# Altium schematic sheet top_schema.SchDoc
size A3; SheetNumber: 1; SheetTotal: 1
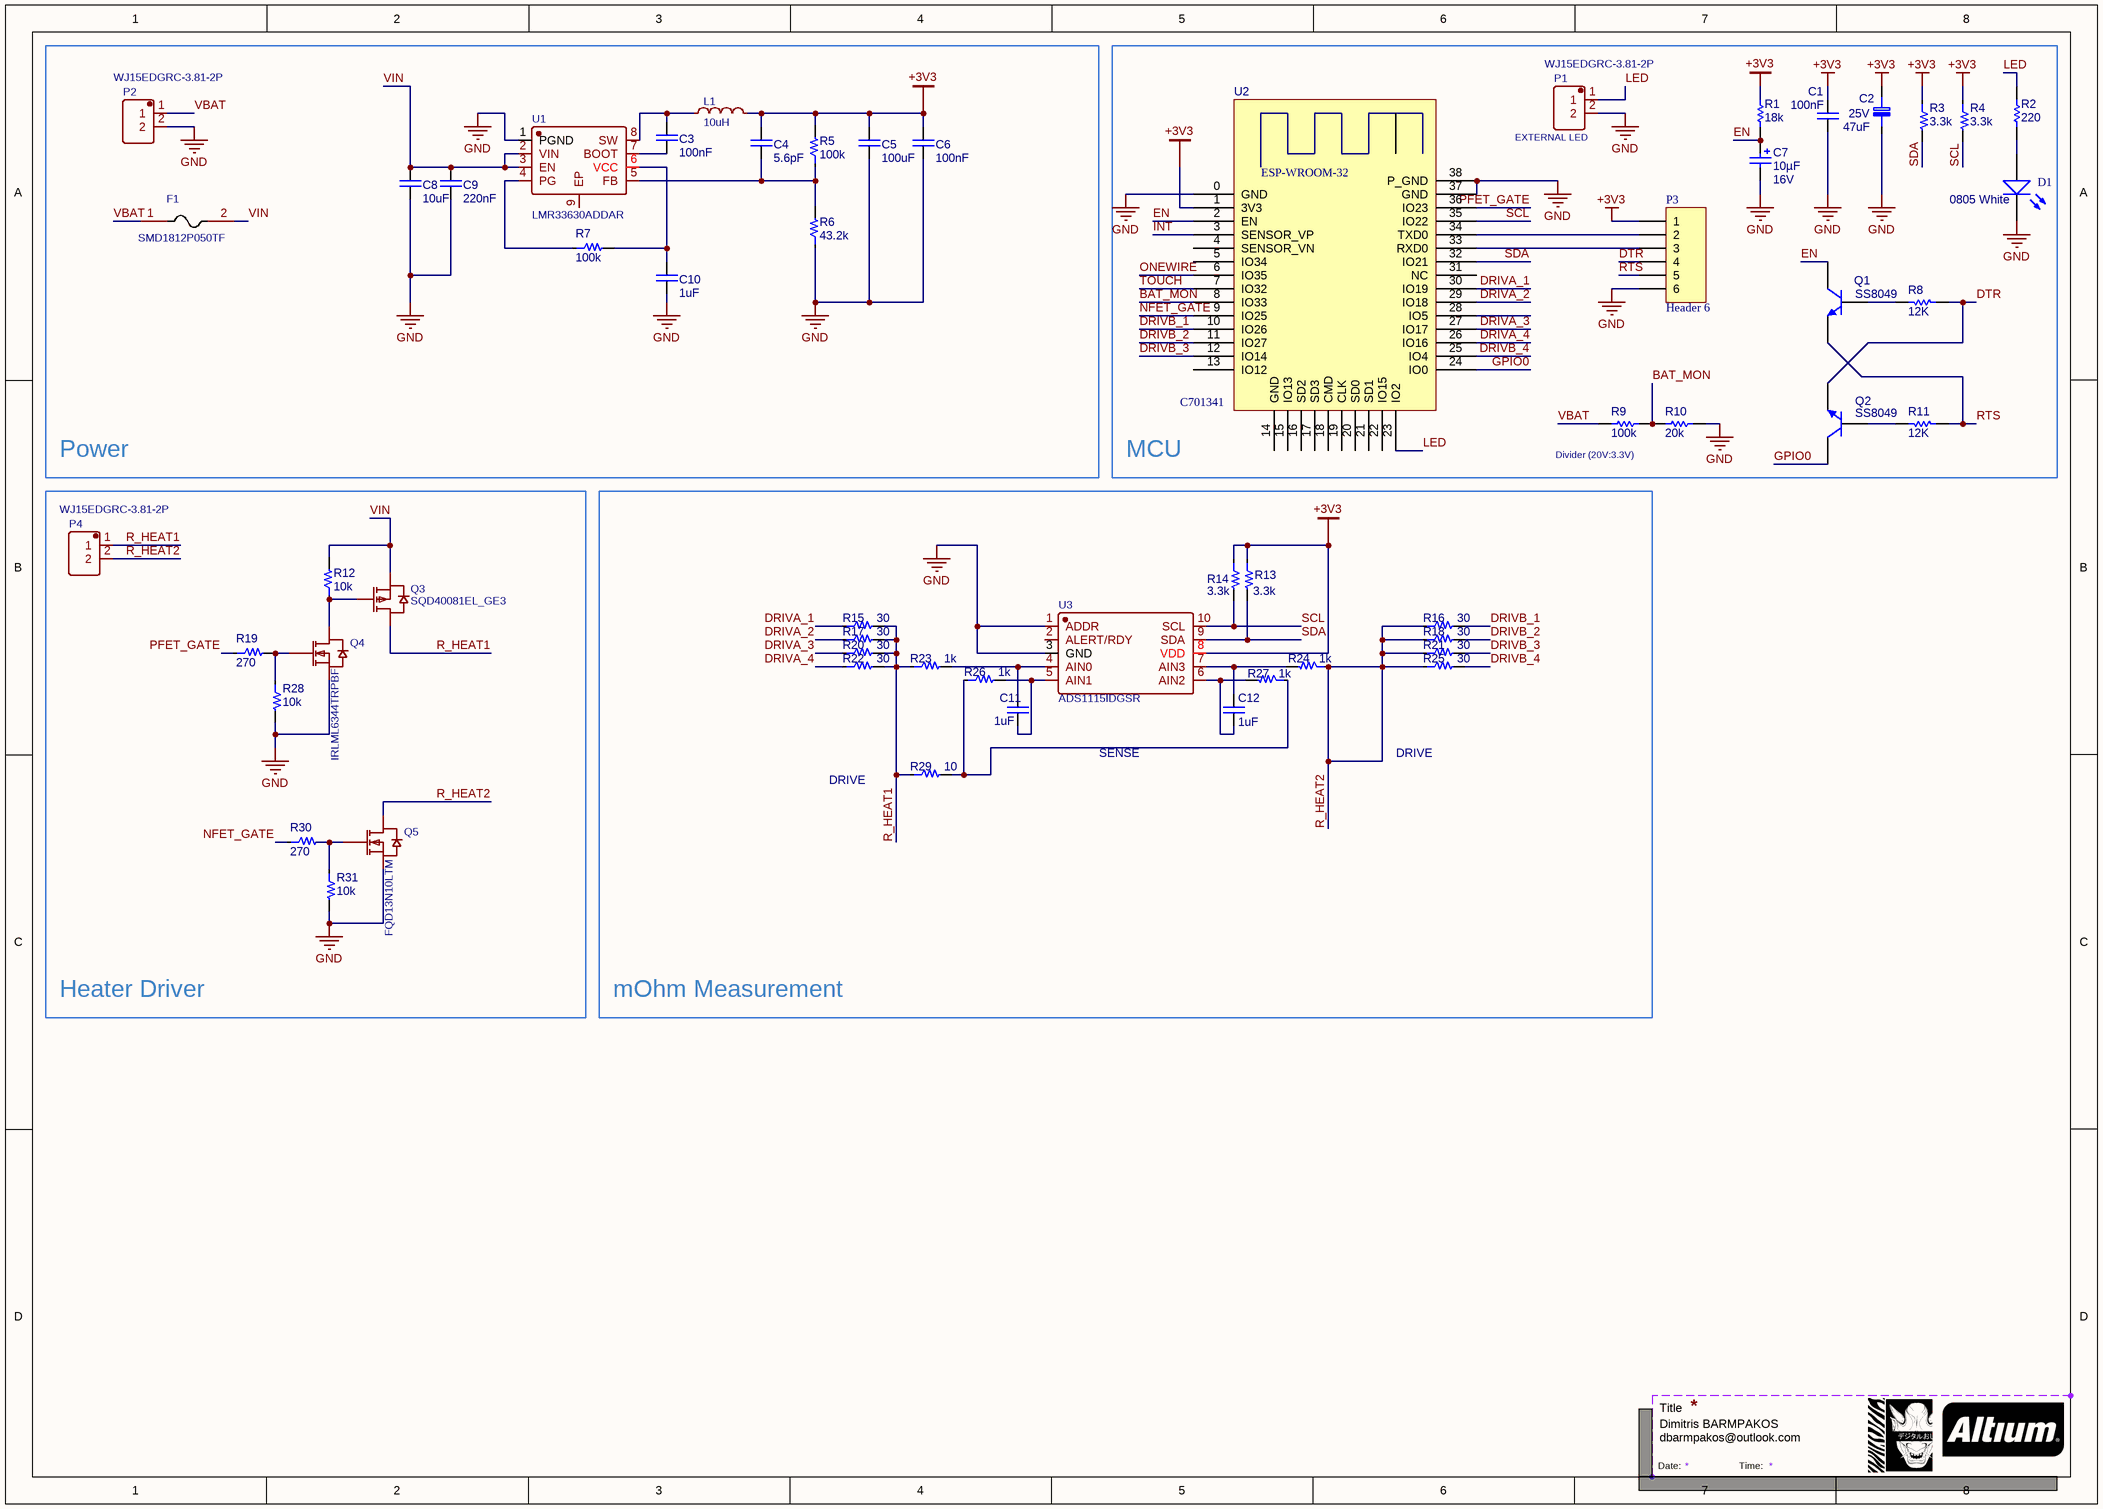
[diagram p0: top_schema.SchDoc]

## Parts
C1  100nF  [CAP_0603]
C2  Voltage Rating: 25V  [CAP SMD 6.3X7.7]  (hidden comment: 47uF)
C3  100nF  [CAP_0603]
C4  5.6pF  [CAP_0603]
C5  100uF  [CAP_0603]
C6  100nF  [CAP_0603]
C7  Capacitance: 10µF  Voltage - Rated: 16V  [CAP_CERAM]  (hidden comment: 10uF)
C8  10uF  [CAP_0603]
C9  220nF  [CAP_0603]
C10  1uF  [CAP_0603]
C11  1uF  [CAP_0603]
C12  1uF  [CAP_0603]
D1  0805 White  [0805_LED_S1]
F1  SMD1812P050TF  [SMT_FUSE]
L1  10uH  [IND-SMD_L5.0-W5.0]
P1  WJ15EDGRC-3.81-2P  [CONN-TH_2P-P3.81_WJ15EDGRC-3.81-2P]
P2  WJ15EDGRC-3.81-2P  [CONN-TH_2P-P3.81_WJ15EDGRC-3.81-2P]
P3  Header 6  [HDR1X6]
P4  WJ15EDGRC-3.81-2P  [CONN-TH_2P-P3.81_WJ15EDGRC-3.81-2P]
Q1  SS8049  [SOT23]
Q2  SS8049  [SOT23]
Q3  SQD40081EL_GE3  [TO-252-3_L6.6-W6.1-P4.57-LS9.9-BR]
Q4  IRLML6344TRPBF  [SOT-23-3_L2.9-W1.6-P1.90-LS2.8-BR]
Q5  FQD13N10LTM  [TO-252-2_L6.6-W6.1-P4.57-LS9.9-TL-CW]
R1  18k  [R0603]
R2  220  [R0603]
R3  3.3k  [R0603]
R4  3.3k  [R0603]
R5  100k  [R0603]
R6  43.2k  [R0603]
R7  100k  [R0603]
R8  12k  [R0603]
R9  100k  [R0603]
R10  20k  [R0603]
R11  12k  [R0603]
R12  10k  [R0603]
R13  3.3k  [R0603]
R14  3.3k  [R0603]
R15  30  [R0603]
R16  30  [R0603]
R17  30  [R0603]
R18  30  [R0603]
R19  270  [R0603]
R20  30  [R0603]
R21  30  [R0603]
R22  30  [R0603]
R23  1k  [R0603]
R24  1k  [R0603]
R25  30  [R0603]
R26  1k  [R0603]
R27  1k  [R0603]
R28  10k  [R0603]
R29  10  [R0603]
R30  270  [R0603]
R31  10k  [R0603]
U1  LMR33630ADDAR  [ESOP-8_L4.9-W3.9-P1.27-LS6.0-TL-EP]
U2  C701341  [ESP32_WROOM]
U3  ADS1115IDGSR  [MSOP-10_L3.0-W3.0-P0.50-LS5.0-BL]

## Blocks framed on the sheet
Power: C3-C6 C8-C10 F1 L1 P2 R5-R7 U1
MCU: C1 C2 C7 D1 P1 P3 Q1 Q2 R1-R4 R8-R11 U2
Heater Driver: P4 Q3-Q5 R12 R19 R28 R30 R31
mOhm Measurement: C11 C12 R13-R18 R20-R27 R29 U3

## Nets
+3V3: C1.1 C2.1 C4.1 C5.1 C6.1 L1.2 P3.1 R1.1 R3.1 R4.1 R5.2 R13.1 R14.1 U2.1(3V3) U3.8(VDD)
GND: C1.2 C2.2 C5.2 C6.2 C7.2 C8.2 C9.2 C10.2 D1.K P1.2 P2.2 P3.6 Q4.2(S) Q5.3(S) R6.1 R10.2 R28.2 R31.2 U1.1(PGND) U2.0(GND) U2.37(GND) U2.38(P_GND) U3.1(ADDR) U3.3(GND)
BAT_MON: R9.2 R10.1 U2.8(IO33)
DRIVA_1: R15.1 U2.30(IO19)
DRIVA_2: R17.1 U2.29(IO18)
DRIVA_3: R20.1 U2.27(IO17)
DRIVA_4: R22.1 U2.26(IO16)
DRIVB_1: R16.2 U2.10(IO26)
DRIVB_2: R18.2 U2.11(IO27)
DRIVB_3: R21.2 U2.12(IO14)
DRIVB_4: R25.2 U2.25(IO4)
DTR: P3.4 Q2.2(E) R8.2
EN: C7.1 Q1.3(C) R1.2 U2.2(EN)
GPIO0: Q2.3(C) U2.24(IO0)
INT: U2.3(SENSOR_VP)
LED: P1.1 R2.2 U2.23(IO2)
NFET_GATE: R30.1 U2.9(IO25)
ONEWIRE: U2.6(IO35)
PFET_GATE: R19.1 U2.36(IO23)
R_HEAT1: P4.1 Q3.3(D) R15.2 R17.2 R20.2 R22.2 R23.1 R29.1
R_HEAT2: P4.2 Q5.2(D) R16.1 R18.1 R21.1 R24.1 R25.1
RTS: P3.5 Q1.2(E) R11.2
SCL: R4.2 R14.2 U2.35(IO22) U3.10(SCL)
SDA: R3.2 R13.2 U2.32(IO21) U3.9(SDA)
TOUCH: U2.7(IO32)
VBAT: F1.1 P2.1 R9.1
VIN: C8.1 C9.1 F1.2 Q3.2(S) R12.2 U1.2(VIN) U1.3(EN)
NetC3_1: C3.1 U1.7(BOOT)
NetC3_2: C3.2 L1.1 U1.8(SW)
NetC4_2: C4.2 R5.1 R6.2 U1.5(FB)
NetC10_1: C10.1 R7.2 U1.6(VCC)
NetC11_1: C11.1 R23.2 U3.4(AIN0)
NetC11_2: C11.2 R26.2 U3.5(AIN1)
NetC12_1: C12.1 R24.2 U3.7(AIN3)
NetC12_2: C12.2 R27.2 U3.6(AIN2)
NetD1_A: D1.A R2.1
NetP3_2: P3.2 U2.34(TXD0)
NetP3_3: P3.3 U2.33(RXD0)
NetQ1_1: Q1.1(B) R8.1
NetQ2_1: Q2.1(B) R11.1
NetQ3_1: Q3.1(G) Q4.3(D) R12.1
NetQ4_1: Q4.1(G) R19.2 R28.1
NetQ5_1: Q5.1(G) R30.2 R31.1
NetR7_1: R7.1 U1.4(PG)
NetR26_1: R26.1 R27.1 R29.2

Not connected (* = marked no-connect by the designer): U1 9(EP); U2 4(SENSOR_VN) 5(IO34) 13(IO12) 14(GND) 15(IO13) 16(SD2) 17(SD3) 18(CMD) 19(CLK) 20(SD0) 21(SD1) 22(IO15) 28(IO5) 31(NC); U3 2(ALERT/RDY)

## Notes on the sheet
- (near P1) EXTERNAL LED
- Divider (20V:3.3V)
- DRIVE
- SENSE
- Title
- Dimitris BARMPAKOS
- dbarmpakos@outlook.com
- Date:
- Time:
- (in symbol ESP 32) ESP-WROOM-32

## Library data of the parts
C1 C3 C6 = CAP - CER 0.1UF 25V X7R 0805: CAP CER 0.1UF 50V X7R 0603; Manufacturer: FH(Guangdong Fenghua Advanced Tech); Manufacturer Part Number: 0603F104M500NT; Pricing 1: 1=0,10000, 10=0,04400, 50=0,02420, 100=0,01980, 500=0,01412, 1000=0,01110 (USD); Case/Package: 0603; Capacitance: 100nF; Voltage Rating: 50V; Voltage: 50V; Length: 1.6mm; Width: 0.031inch; Height: 0.8mm; Thickness: 0.035inch; Depth: 0.8mm; Supplier 1: JLCPCB; Supplier Part Number 1: C42998
C2 = CAP 22UF 63V SMD: CAP ALUM 22UF 20% 25V SMD; Manufacturer: Nichicon; Manufacturer Part Number: UWX1E220MCL1GB; Dielectric Material: Aluminium; Ripple Current: 42mA; Polarity: Polar; Leakage Current: 3uA; Life (Hours): 2000Hour; Dissipation Factor: 0.14%; Supplier 1: Digi-Key; Supplier Part Number 1: 493-2109-1-ND; RoHS: Yes; Category: Aluminum Electrolytic Capacitors; Stock 1: 5009; Pricing 1: 1=0,36000, 10=0,25200, 50=0,17620, 100=0,15110, 500=0,11334 (USD); Mount: Surface Mount; Case/Package: SMD/SMT; Weight: 0.01lb; Contact Plating: Tin; Min Operating Temperature: -40°C; Max Operating Temperature: 85°C; Capacitance: 47uF; Tolerance: 20%; Package Quantity: 1000; Packaging: Tape and Reel; Ripple Current (AC): 42mA; Voltage Rating (DC): 25V; Termination: SMD/SMT; Voltage: 25V; Series: WX; Construction: Cylindrical; Diameter: 6.3mm; Length: 5.4mm; Width: 0.25inch; Height: 5.4mm; Height - Seated (Max): 0.213inch; Lead Pitch: 2.2mm; Radiation Hardening: No; REACH SVHC: No SVHC; Lead Free: Lead Free; RoHS Compliant: Yes; ComponentLink1URL: https://datasheet.ciiva.com/96/e-wx-96336.pdf?src-supplier=Digi-Key; ComponentLink1Description: https://datasheet.ciiva.com/96/e-wx-96336.pdf?src-supplier=Digi-Key; ComponentLink2URL: https://datasheet.ciiva.com/16352/e-wx-16352999.pdf?src-supplier=Future+Electronics; ComponentLink2Description: https://datasheet.ciiva.com/16352/e-wx-16352999.pdf?src-supplier=Future+Electronics; ComponentLink3URL: https://datasheet.ciiva.com/28640/e-wx-28640455.pdf?src-supplier=Element14; ComponentLink3Description: https://datasheet.ciiva.com/28640/e-wx-28640455.pdf?src-supplier=Element14; ComponentLink4URL: https://datasheet.ciiva.com/17529/e-wx-17529096.pdf?src-supplier=Avnet+Europe; ComponentLink4Description: https://datasheet.ciiva.com/17529/e-wx-17529096.pdf?src-supplier=Avnet+Europe; ComponentLink5URL: https://datasheet.ciiva.com/7851/59577-7851769.pdf?src-supplier=Element14; ComponentLink5Description: https://datasheet.ciiva.com/7851/59577-7851769.pdf?src-supplier=Element14; ComponentLink6URL: https://datasheet.ciiva.com/11687/e-wx-11687963.pdf?src-supplier=Avnet; ComponentLink6Description: https://datasheet.ciiva.com/11687/e-wx-11687963.pdf?src-supplier=Avnet; ComponentLink7URL: https://datasheet.ciiva.com/96/e-wx-96334.pdf?src-supplier=Digi-Key; ComponentLink7Description: https://datasheet.ciiva.com/96/e-wx-96334.pdf?src-supplier=Digi-Key; ComponentLink8URL: https://datasheet.ciiva.com/5361/e-wx-11809-5361166.pdf?src-supplier=Mouser; ComponentLink8Description: https://datasheet.ciiva.com/5361/e-wx-11809-5361166.pdf?src-supplier=Mouser; ComponentLink9URL: https://datasheet.ciiva.com/96/e-wx-96335.pdf?src-supplier=Digi-Key; ComponentLink9Description: https://datasheet.ciiva.com/96/e-wx-96335.pdf?src-supplier=Digi-Key
C4 C5 C8-C12 = CAP - CER 0.1UF 25V X7R 0805: CAP CER 0.1UF 50V X7R 0603; Manufacturer: FH(Guangdong Fenghua Advanced Tech); Manufacturer Part Number: 0603F104M500NT; Capacitance: 100nF; Pricing 1: 1=0,10000, 10=0,04400, 50=0,02420, 100=0,01980, 500=0,01412, 1000=0,01110 (USD); Case/Package: 0603; Voltage Rating: 50V; Voltage: 50V; Length: 1.6mm; Width: 0.031inch; Height: 0.8mm; Thickness: 0.035inch; Depth: 0.8mm; Supplier 1: JLCPCB; Supplier Part Number 1: C42998
C7 = Capacitor Polarized: Tantalum Capacitor; Manufacturer: Kemet; Manufacturer Part Number: T491A106K016AT; Manufacturer Size Code: A; Tolerance: ±10%; ESR (Equivalent Series Resistance): 7 Ohm; Type: Molded; Lifetime @ Temp.: 2000 Hrs @ 85°C; Supplier 1: Digi-Key; Supplier Part Number 1: 399-8269-1-ND; RoHS: RoHS Compliant; Category: Capacitors; Stock 1: 46669; Pricing 1: 1=0.41, 10=0.362, 50=0.2198, 100=0.181, 250=0.14476, 500=0.13184, 1000=0.11891 (USD); Packaging: Cut Tape (CT); Operating Temperature: -55°C ~ 125°C; Mounting Type: Surface Mount; Package / Case: 1206 (3216 Metric); Size / Dimension: 0.126" L x 0.063" W (3.20mm x 1.60mm); Height - Seated (Max): 0.071" (1.80mm); Lead Spacing: -; Features: General Purpose; ComponentLink1URL: http://www.kemet.com/Lists/ProductCatalog/Attachments/254/KEM_T2005_T491.pdf; ComponentLink1Description: http://www.kemet.com/Lists/ProductCatalog/Attachments/254/KEM_T2005_T491.pdf
D1 = 0805 LED White: LED; Color: White; ComponentLink1URL: http://www.szlcsc.com/product/details_35468.html; ComponentLink1Description: 供应商链接; Package: 0805; Supplier: LC; SuppliersPartNumber: C34499
F1 = SMD1812P050TF: C12559; BOM_Manufacturer: RUILON; BOM_Supplier: LCSC; BOM_Manufacturer Part: SMD1812P050TF; BOM_Supplier Part: C12558; BOM_JLCPCB Part Class: Extended Part; spicePre: F; spiceSymbolName: SMD1812P050TF
L1 = 10uH: BOM_Manufacturer: Sunlord(顺络); BOM_Manufacturer Part: SWPA5040S100MT; nameAlias: Inductance; BOM_Supplier: LCSC; BOM_Supplier Part: C84608; BOM_JLCPCB Part Class: Extended Part; spicePre: L; spiceSymbolName: SWPA5040S100MT
P1 P2 P4 = WJ15EDGRC-3.81-2P: C8387; BOM_Manufacturer: ReliaPro; spicePre: X; BOM_Supplier: LCSC; BOM_Manufacturer Part: WJ15EDGRC-3.81-2P; BOM_Supplier Part: C8387; BOM_JLCPCB Part Class: Extended Part; spiceSymbolName: WJ15EDGRC-3.81-2P
P3 = Header 6: Header, 6-Pin; LatestRevisionDate: 17-Jul-2002; LatestRevisionNote: Re-released for DXP Platform.; Publisher: Altium Limited
Q1 Q2 = NPN: NPN Bipolar Transistor; Published: 8-Jun-2000; LatestRevisionDate: 17-Jul-2002; LatestRevisionNote: Re-released for DXP Platform.; PackageReference: TO-226-AA; Publisher: Altium Limited; PackageDescription: TO, Flat Index; 3 In-Line, Axial Leads; Body Dia. 4.8mm; Leads 0.55 x 0.51 mm (max); Code_JEDEC: TO-226-AA
Q3 = SQD40081EL_GE3: BOM_Manufacturer: VISHAY(威世); Contributor: LCSC; BOM_Supplier: LCSC; BOM_Supplier Part: C727779; BOM_Manufacturer Part: SQD40081EL_GE3; BOM_JLCPCB Part Class: Extended Part; spicePre: Q; spiceSymbolName: SQD40081EL_GE3
Q4 = IRLML6344TRPBF: BOM_Manufacturer: Infineon(英飞凌); Contributor: LCSC; BOM_Supplier: LCSC; BOM_Manufacturer Part: IRLML6344TRPBF; BOM_Supplier Part: C53550; BOM_JLCPCB Part Class: Extended Part; spicePre: Q; spiceSymbolName: IRLML6344TRPBF
Q5 = FQD13N10LTM: BOM_Manufacturer: FAIRCHILD; BOM_Supplier: LCSC; BOM_Manufacturer Part: FQD13N10LTM; BOM_Supplier Part: C37552; BOM_JLCPCB Part Class: Extended Part; spicePre: Q; spiceSymbolName: FQD13N10LTM
R1 R2 R9 R10 = Res1: Res Thick Film 0603 1M Ohm 1% 0.1W(1/10W) ±100ppm/C Pad SMD T/R; Manufacturer: TE Connectivity; Manufacturer Part Number: CRG0603F1M0; Power Rating: 100mW; Temperature Coefficient: 100ppm/°C; Number of Resistors: 1; Voltage Rating: 50V; Supplier 1: Digi-Key; Supplier Part Number 1: A121559CT-ND; RoHS: Yes; Category: Chip SMD Resistors; Stock 1: 32347; Pricing 1: 1=0,10000, 10=0,02800, 100=0,01130, 1000=0,00506, 2500=0,00439 (USD); Mount: Surface Mount; Case/Package: 0603; Case Code (Imperial): 0603; Weight: 7.1E-05oz; Min Operating Temperature: -55°C; Max Operating Temperature: 125°C; Package Quantity: 5000; Tolerance: 1%; Packaging: Tape and Reel; Resistor Type: Thick Film; Number of Terminations: 2; Max Power Dissipation: 100mW; Termination: Solder; Series: CRG, Neohm; Technology: THICK FILM; Construction: Rectangular; Length: 1.6mm; Width: 0.8mm; Height: 0.45mm; Depth: 0.8mm; Radiation Hardening: No; Military Standard: Not; Lead Free: Lead Free; ELV: Compliant; RoHS Compliant: Yes
  R1: Resistance: 18k
  R2: Resistance: 220
  R9: Resistance: 100k
  R10: Resistance: 20k
R3-R7 R12-R31 = Res 1k ±1% 0.063W 0402: Manufacturer: UNI-ROYAL(Uniroyal Elec); Manufacturer Part Number: 0603WAJ0472T5E; ComponentLink1URL: https://lcsc.com/product-detail/Chip-Resistor-Surface-Mount_Resistor-Today-AECR0402F1K00K9_C328304.html; Supplier 1: JLCPCB; Package / Case: 0603; Supplier Part Number 1: C25999
  R3 R4 R13 R14: Resistance: 3.3k
  R5 R7: Resistance: 100k
  R6: Resistance: 43.2k
  R12 R28 R31: Resistance: 10k
  R15-R18 R20-R22 R25: Resistance: 30
  R19 R30: Resistance: 270
  R23 R24 R26 R27: Resistance: 1k
  R29: Resistance: 10
R8 R11 = 1: Res Thkflm Anti-sulfurated 0603 100K Ohm 5% SMD; Manufacturer: Panasonic; Manufacturer Part Number: ERJ-U03J104V; Current Rating: 1A; Voltage Rating (DC): 75V; Power Rating: 100mW; Supplier 1: Digi-Key; Supplier Part Number 1: 10-ERJ-U03J104VCT-ND; Category: Chip SMD Resistors; Stock 1: 1856; Pricing 1: 1=0,10000, 10=0,07700, 100=0,02950, 1000=0,01298, 2500=0,01121 (USD); Case/Package: 0603; Weight: 7.1E-05oz; Case Code (Imperial): 0603; Case Code (Metric): 1608; Min Operating Temperature: -55°C; Max Operating Temperature: 155°C; Resistance: 12K; Tolerance: 5%; Voltage Rating: 75V; Packaging: Tape and Reel; Package Quantity: 5000; Resistor Type: Thick Film; Termination: SMD/SMT; Length: 1.6mm; Width: 0.8mm; Height: 0.45mm; ComponentLink1URL: http://industrial.panasonic.com/www-cgi/jvcr13pz.cgi?E+PZ+3+AOA0005+ERJS06J821V+7+WW?src-supplier=Mouser; ComponentLink1Description: http://industrial.panasonic.com/www-cgi/jvcr13pz.cgi?E+PZ+3+AOA0005+ERJS06J821V+7+WW?src-supplier=Mouser; ComponentLink2URL: http://datasheet.octopart.com/ERJ-U03J104V-Panasonic-datasheet-61627662.pdf?src-supplier=Newark; ComponentLink2Description: http://datasheet.octopart.com/ERJ-U03J104V-Panasonic-datasheet-61627662.pdf?src-supplier=Newark; ComponentLink3URL: http://datasheet.octopart.com/ERJ-U03J104V-Panasonic-datasheet-33006993.pdf?src-supplier=Newark; ComponentLink3Description: http://datasheet.octopart.com/ERJ-U03J104V-Panasonic-datasheet-33006993.pdf?src-supplier=Newark; ComponentLink4URL: http://datasheet.octopart.com/ERJ-U03J104V-Panasonic-datasheet-78375410.pdf; ComponentLink4Description: http://datasheet.octopart.com/ERJ-U03J104V-Panasonic-datasheet-78375410.pdf
U1 = LMR33630ADDAR_1: BOM_Manufacturer: TI(德州仪器); Contributor: LCSC; BOM_Supplier: LCSC; BOM_Supplier Part: C841384; BOM_Manufacturer Part: LMR33630ADDAR; BOM_JLCPCB Part Class: Extended Part; spicePre: U; spiceSymbolName: LMR33630ADDAR
U2 = ESP 32
U3 = ADS1115IDGSR: C37593; BOM_Manufacturer: TI; BOM_Supplier: LCSC; BOM_Manufacturer Part: ADS1115IDGSR; BOM_Supplier Part: C37593; BOM_JLCPCB Part Class: Extended Part; spicePre: U; spiceSymbolName: ADS1115IDGSR